# EAGLE design Anthe (EAGLE 9.6.2)
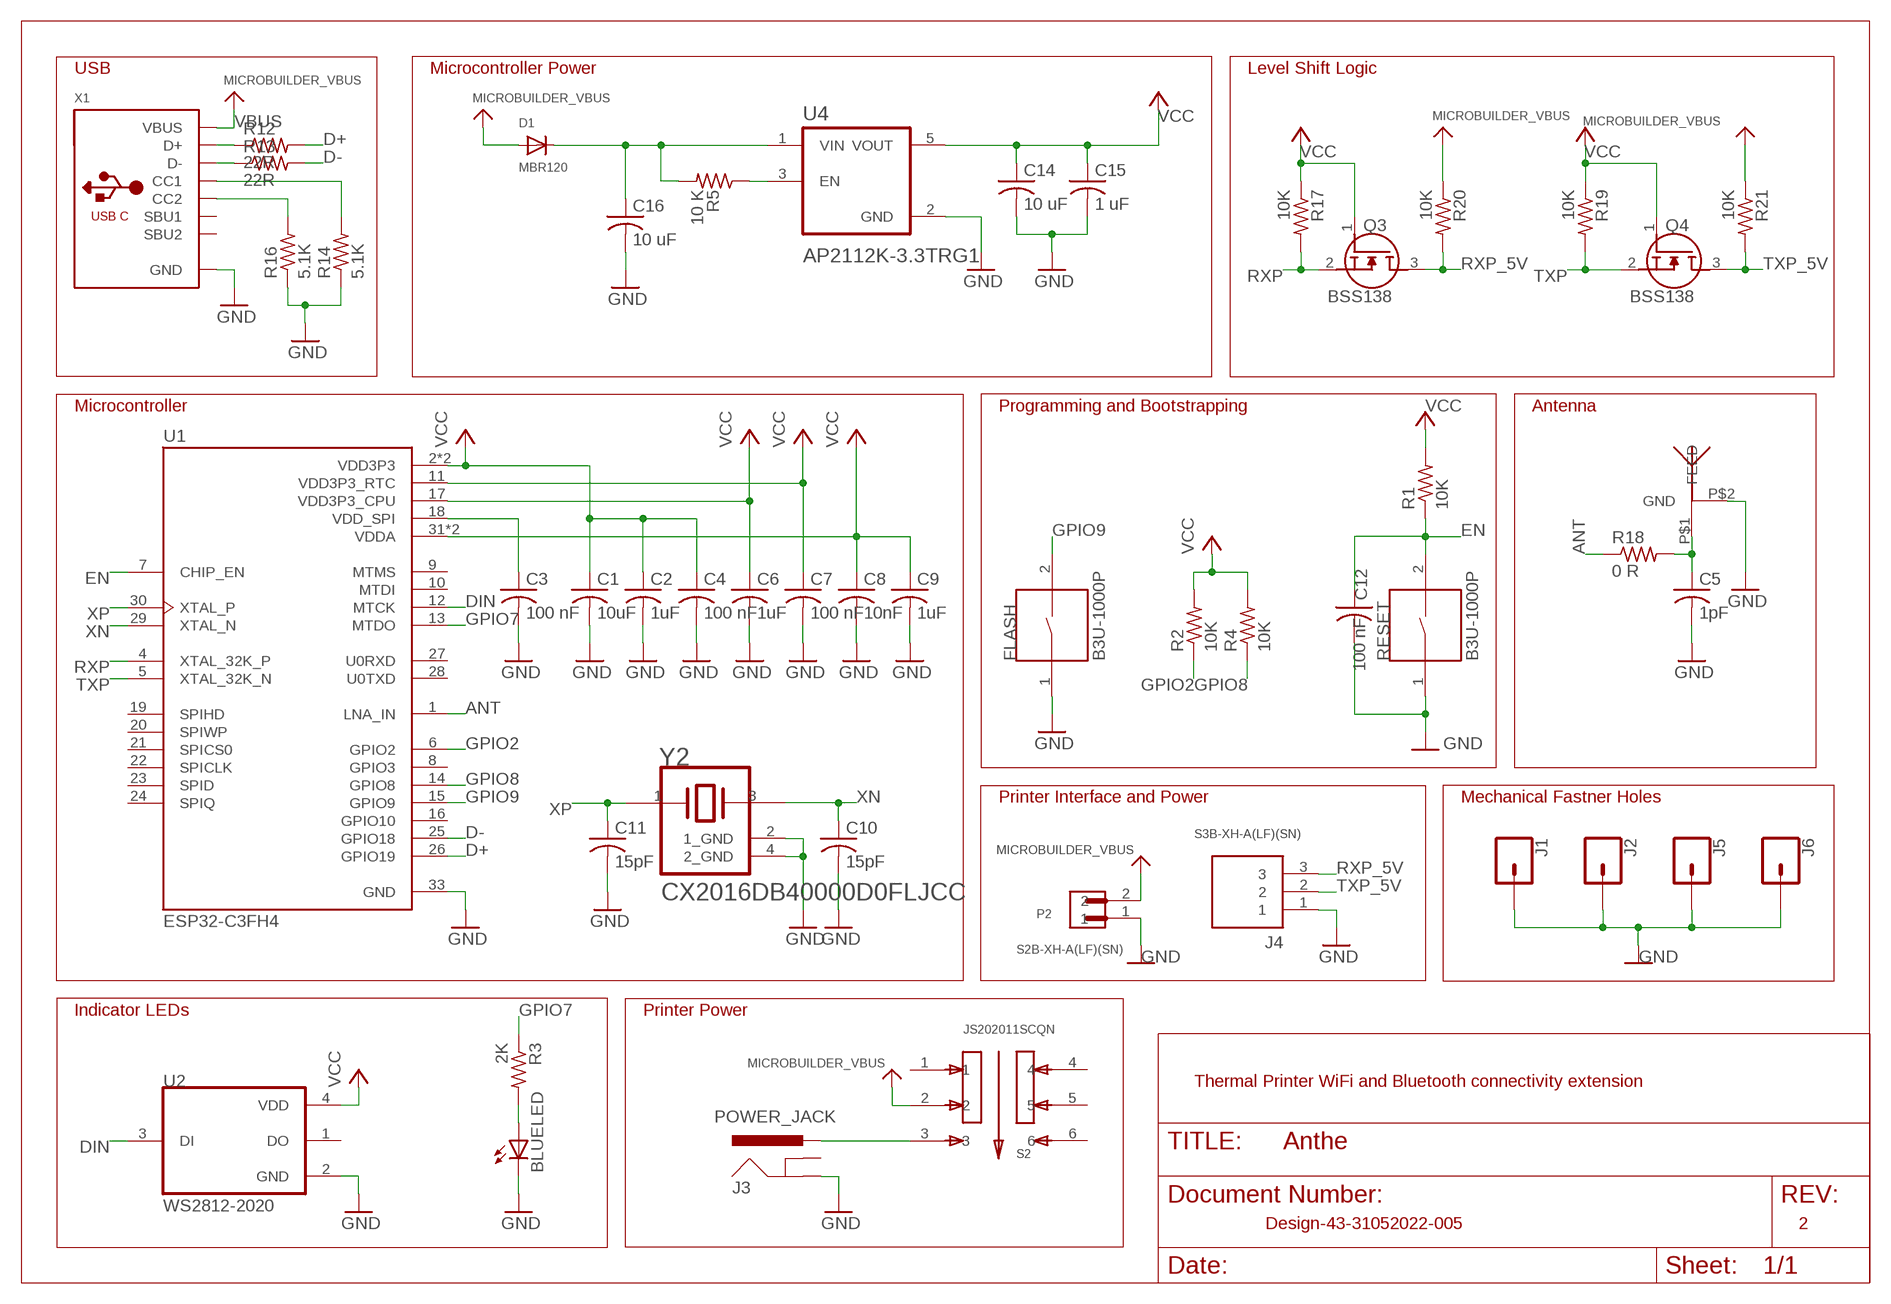
[diagram p0: schematic, sheet 1]

## Parts
BLUELED  LEDCHIPLED_0603  [CHIPLED_0603]
C1  10uF  C-USC0402  [C0402]
C2  1uF  C-USC0402  [C0402]
C3  100 nF  C-USC0402  [C0402]
C4  100 nF  C-USC0402  [C0402]
C5  1pF  C-USC0402  [C0402]
C6  1uF  C-USC0402  [C0402]
C7  100 nF  C-USC0402  [C0402]
C8  10nF  C-USC0402  [C0402]
C9  1uF  C-USC0402  [C0402]
C10  15pF  C-USC0402  [C0402]
C11  15pF  C-USC0402  [C0402]
C12  100 nF  C-USC0402  [C0402]
C14  10 uF  C-USC0402  [C0402]
C15  1 uF  C-USC0402  [C0402]
C16  10 uF  C-USC0402  [C0402]
D1  MBR120  DIODESOD-123  [SOD-123]
FLASH  B3U-1000P  [SW_B3U-1000P]
J1  CONN_01PTH_2MM  [1X01_2MM]
J2  CONN_01PTH_2MM  [1X01_2MM]
J3  POWER_JACK  [POWER_JACK_PTH]
J4  S3B-XH-A(LF)(SN)  [JST_S3B-XH-A(LF)(SN)]
J5  CONN_01PTH_2MM  [1X01_2MM]
J6  CONN_01PTH_2MM  [1X01_2MM]
P2  S2B-XH-A(LF)(SN)  [JST_S2B-XH-A(LF)(SN)]
Q3  BSS138  [SOT95P240X120-3N]
Q4  BSS138  [SOT95P240X120-3N]
R1  10K  R-US_R0402  [R0402]
R2  10K  R-US_R0402  [R0402]
R3  2K  R-US_R0402  [R0402]
R4  10K  R-US_R0402  [R0402]
R5  10 K  R-US_R0402  [R0402]
R12  22R  R-US_R0402  [R0402]
R13  22R  R-US_R0402  [R0402]
R14  5.1K  R-US_R0402  [R0402]
R16  5.1K  R-US_R0402  [R0402]
R17  10K  R-US_R0402  [R0402]
R18  0 R  R-US_R0402  [R0402]
R19  10K  R-US_R0402  [R0402]
R20  10K  R-US_R0402  [R0402]
R21  10K  R-US_R0402  [R0402]
RESET  B3U-1000P  [SW_B3U-1000P]
S2  JS202011SCQN  [SW_JS202011SCQN]
U1  ESP32-C3FH4  [QFN50P500X500X90-33N]
U2  WS2812-2020  [LED_WS2812-2020]
U4  AP2112K-3.3TRG1  [SOT95P285X140-5N]
U$3  PCB_ANTENNA_WIFI  [WIFI_ANTENNA]
X1  MICROBUILDER_USB_C  [MICROBUILDER_USB_C_CUSB31-CFM2AX-01-X]
Y2  KYOCERA_INTERNATIONAL_INC._ELECTRONIC_COMPONENTS_CX2016DB40000D0FLJCCKYOCERA_INTERNATIONAL_INC._ELECTRONIC_COMPONENTS_CX2016DB40000D0FLJCC_0_0  [KYOCERA_INTERNATIONAL_INC._ELECTRONIC_COMPONENTS_CX2016DB40000D0FLJCC_0]

## Nets
ANT: R18.1 U1.1(LNA_IN)
D+: R12.2 U1.26(GPIO19)
D-: R13.2 U1.25(GPIO18)
DIN: U1.12(MTCK) U2.3(DI)
EN: C12.1 R1.1 RESET.2 U1.7(CHIP_EN)
GND: BLUELED.C C1.2 C2.2 C3.2 C4.2 C5.2 C6.2 C7.2 C8.2 C9.2 C10.2 C11.2 C12.2 C14.2 C15.2 C16.2 FLASH.1 J1.1 J2.1 J3.GND J4.1 J5.1 J6.1 P2.1 R14.1 R16.1 RESET.1 U1.33(GND) U2.2(GND) U4.2(GND) U$3.P$2(GND) X1.A1B12(GND) X1.B1A12(GND) Y2.2(1_GND) Y2.4(2_GND)
GPIO2: R2.1 U1.6(GPIO2)
GPIO7: R3.1 U1.13(MTDO)
GPIO8: R4.1 U1.14(GPIO8)
GPIO9: FLASH.2 U1.15(GPIO9)
N$1: J3.PWR S2.3
N$2: C5.1 R18.2 U$3.P$1(FEED)
N$4: C3.1 U1.18(VDD_SPI)
N$5: BLUELED.A R3.2
N$8: R12.1 X1.A6(D+) X1.B6(D+)
N$10: C16.1 D1.C R5.2 U4.1(VIN)
N$13: R13.1 X1.A7(D-) X1.B7(D-)
N$14: R14.2 X1.A5(CC1)
N$15: R16.2 X1.B5(CC2)
N$31: R5.1 U4.3(EN)
RXP: Q3.2(S) R17.2 U1.4(XTAL_32K_P)
RXP_5V: J4.3 Q3.3(D) R20.2
TXP: Q4.2(S) R19.2 U1.5(XTAL_32K_N)
TXP_5V: J4.2 Q4.3(D) R21.2
VBUS: D1.A P2.2 R20.1 R21.1 S2.2 X1.A4B9(VBUS) X1.B4A9(VBUS) ; supply symbol labelled MICROBUILDER_VBUS
VCC: C1.1 C2.1 C4.1 C6.1 C7.1 C8.1 C9.1 C14.1 C15.1 Q3.1(G) Q4.1(G) R1.2 R2.2 R4.2 R17.1 R19.1 U1.2(VDD3P3) U1.3(VDD3P3) U1.11(VDD3P3_RTC) U1.17(VDD3P3_CPU) U1.31(VDDA) U1.32(VDDA) U2.4(VDD) U4.5(VOUT)
XN: C10.1 U1.29(XTAL_N) Y2.3
XP: C11.1 U1.30(XTAL_P) Y2.1
Unconnected: J3.GNDBREAK S2.1 S2.4 S2.5 S2.6 U1.8(GPIO3) U1.9(MTMS) U1.10(MTDI) U1.16(GPIO10) U1.19(SPIHD) U1.20(SPIWP) U1.21(SPICS0) U1.22(SPICLK) U1.23(SPID) U1.24(SPIQ) U1.27(U0RXD) U1.28(U0TXD) U2.1(DO) X1.A8(SBU1) X1.B8(SBU2)

## Notes on the sheet
- USB | Microcontroller Power | Level Shift Logic
- Microcontroller | Programming and Bootstrapping | Antenna
- Printer Interface and Power | Mechanical Fastner Holes
- Indicator LEDs | Printer Power
- Thermal Printer WiFi and Bluetooth connectivity extension
- Design-43-31052022-005 | 2

## Library data of the parts
BLUELED = adafruit:LED: LED OSRAM: - CHIPLED LG R971, LG N971, LY N971, LG Q971, LY Q971, LO R971, LY R971 LH N974, LH R974 LS Q976, LO Q976, LY Q976 LO Q996 - Hyper CHIPLED LW Q18S LB Q993, LB Q99A, LB R99A - SideLED LS A670, LO A670, LY A670, LG A670, LP A670 LB A673, LV A673, LT A673, LW A673 LH A674 LY A675 LS A676, LA A676, LO A676, LY A676, LW A676 LS A679, LY A679, LG A679 - Hyper Micro SIDELED® LS Y876, LA Y876, LO Y876, LY Y876 LT Y87S - SmartLED LW L88C, LW L88S LB L89C, LB L89S, LG L890 LS L89K, LO L89K, LY L89K LS L896, LA L896, LO L896, LY L896 - TOPLED LS T670, LO T670, LY T670, LG T670, LP T670 LSG T670, LSP T670, LSY T670, LOP T670, LYG T670 LG T671, LOG T671, LSG T671 LB T673, LV T673, LT T673, LW T673 LH T674 LS T676, LA T676, LO T676, LY T676, LB T676, LH T676, LSB T676, LW T676 LB T67C, LV T67C, LT T67C, LS T67K, LO T67K, LY T67K, LW E67C LS E67B, LA E67B, LO E67B, LY E67B, LB E67C, LV E67C, LT E67C LW T67C LS T679, LY T679, LG T679 LS T770, LO T770, LY T770, LG T770, LP T770 LB T773, LV T773, LT T773, LW T773 LH T774 LS E675, LA E675, LY E675, LS T675 LS T776, LA T776, LO T776, LY T776, LB T776 LHGB T686 LT T68C, LB T68C - Hyper Mini TOPLED® LB M676 - Mini TOPLED Santana® LG M470 LS M47K, LO M47K, LY M47K Source: http://www.osram.convergy.de/
C1-C12 C14-C16 = adafruit:C-US: CAPACITOR, American symbol
D1 = adafruit:DIODE: Diode SMADIODE - SMA Surface Mount Package 20V 1A Schottky Diode Digikey: 641-1014-6-ND DO-1N4148 - Through Hole Small Current Diode SOD-123 20V 1 A (.5mV Vf) Schottky Diode - Digikey: MBRX120TPMSCT-ND SOD-323 10V 570mA (.38mV Vf, 3ns) Schottky Diode - Digikey: ZLLS410CT-ND SOD-523 30V 30mA Schottky Diode (RB751S-40TE61) - Digikey: RB751S-40TE61CT-ND SOT23-R/W - SOT23 Package (R = Solder Paste/Reflow Ovens, W = Hand-Soldering) BAT54Film 40V 300mA - Digikey: 497-7162-1-ND
FLASH RESET = B3U-1000P:B3U-1000P: Switch Tactile N.O. SPST Round Button Gull Wing 0.05A 12VDC 1.5N SMD Embossed T/R; AVAILABILITY: Unavailable; DESCRIPTION: Switch Tactile N.O. SPST Round Button Gull Wing 0.05A 12VDC 1.5N SMD Embossed T/R; MF: Omron; MP: B3U-1000P; PACKAGE: None; PRICE: None
J1 J2 J5 J6 = SparkFun-Connectors:CONN_01: Single connection point. Often used as Generic Header-pin footprint for 0.1 inch spaced/style header connections On any of the 0.1 inch spaced packages, you can populate with these: Break Away Headers - Straight <https://www.sparkfun.com/products/116> (PRT-00116) Break Away Male Headers - Right Angle <https://www.sparkfun.com/products/553> (PRT-00553) Female Headers <https://www.sparkfun.com/products/115> (PRT-00115) Break Away Headers - Machine Pin <https://www.sparkfun.com/products/117> (PRT-00117) Break Away Female Headers - Swiss Machine Pin <https://www.sparkfun.com/products/743> (PRT-00743) This device is also useful as a general connection point to wire up your design to another part of your project. Our various solder wires solder well into these plated through hole pads. Hook-Up Wire - Assortment (Stranded, 22 AWG) <https://www.sparkfun.com/products/11375> (PRT-11375) Hook-Up Wire - Assortment (Solid Core, 22 AWG) <https://www.sparkfun.com/products/11367> (PRT-11367) View the entire wire category on our website here <https://www.sparkfun.com/categories/141> Special notes: SMTSO-256-ET is a "flush mount" nut for a 4-40 screw. We mostly use this on specialty testbeds; it is a nice way to connect hardware to your PCB at an adjustable hieght. Also note, the SNAP packages are for using a snappable style connector. We sell a baggie of snaps and they are also used on two LilyPad designs: Snap Assortment - 30 pack (male and female) <https://www.sparkfun.com/products/11347> (DEV-11347) LilyPad Arduino SimpleSnap <https://www.sparkfun.com/products/10941> (DEV-10941) LilyPad SimpleSnap Protoboard <https://www.sparkfun.com/products/10940> (DEV-10940)
J3 = SparkFun-Connectors:POWER_JACK: Power Jack Connector This is the standard 5.5mm barrel jack for power. The PTH is the most common, proven, reliable, footprint. The Slot footprint only works if the mill layer is transmitted to the PCB fab house so be warned. Here are the connectors we sell at SparkFun: DC Barrel Power Jack/Connector <https://www.sparkfun.com/products/119> (PRT-00119) DC Barrel Power Jack/Connector (SMD) <https://www.sparkfun.com/products/12748> (PRT-12748) DC Barrel Jack Adapter - Breadboard Compatible <https://www.sparkfun.com/products/10811> (PRT-10811) It is used on this SparkFun product (and many, many others): SparkFun RedBoard - Programmed with Arduino <https://www.sparkfun.com/products/12757> (DEV-12757) Also, if you need a mating power supply or connector, please check these out: Wall Adapter Power Supply - 9VDC 650mA <https://www.sparkfun.com/products/298> (TOL-00298) DC Barrel Jack Adapter - Male <https://www.sparkfun.com/products/10287> (PRT-10287); PROD_ID: CONN-08197
J4 = S3B-XH-A_LF__SN_:S3B-XH-A(LF)(SN): Connector Header Through Hole, Right Angle 3 position 0.098" (2.50mm) Check availability <https://pricing.snapeda.com/parts/S3B-XH-A%28LF%29%28SN%29/JST%20Sales%20America%20Inc./view-part?ref=eda>; AVAILABILITY: In Stock; DESCRIPTION: Connector Header Through Hole, Right Angle 3 position 0.098 (2.50mm); MF: JST Sales America Inc.; MP: S3B-XH-A(LF)(SN); PACKAGE: Custom Package JST Sales; PRICE: None; PURCHASE-URL: https://pricing.snapeda.com/search/part/S3B-XH-A(LF)(SN)/?ref=eda
P2 = S2B-XH-A_LF__SN_:S2B-XH-A(LF)(SN): XH Series 2.5mm 2 Position Through Hole Shrouded Header Connector Check availability <https://pricing.snapeda.com/parts/S2B-XH-A%20%28LF%29%28SN%29/JST%20Sales/view-part?ref=eda>; AVAILABILITY: In Stock; DESCRIPTION: Connector Header Through Hole, Right Angle 2 position 0.098 (2.50mm); MF: JST Sales; MP: S2B-XH-A (LF)(SN); PACKAGE: None; PRICE: None; PURCHASE-URL: https://pricing.snapeda.com/search/part/S2B-XH-A (LF)(SN)/?ref=eda
Q3 Q4 = BSS138:BSS138: N-channel MOSFET,BSS138 0.2A 50V Source: Datasheet <https://componentsearchengine.com/Datasheets/1/BSS138.pdf>; DESCRIPTION: N-channel MOSFET,BSS138 0.2A 50V; HEIGHT: 1.2mm; MANUFACTURER_NAME: ON Semiconductor; MANUFACTURER_PART_NUMBER: BSS138; MOUSER_PART_NUMBER: 512-BSS138; MOUSER_PRICE-STOCK: https://www.mouser.com/Search/Refine.aspx?Keyword=512-BSS138
R1-R5 R12-R14 R16-R21 = adafruit:R-US_: RESISTOR, American symbol
S2 = JS202011SCQN:JS202011SCQN: JS Series DPDT On-On Gull Wing Surface Mount Subminiature Slide Switch; AVAILABILITY: Unavailable; DESCRIPTION: Slide Switch DPDT Surface Mount; MF: C&K; MP: JS202011SCQN; PACKAGE: None; PRICE: None
U1 = ESP32-C3FH4:ESP32-C3FH4: Check availability <https://pricing.snapeda.com/parts/ESP32-C3FH4/Espressif%20Systems/view-part?ref=eda>; AVAILABILITY: In Stock; DESCRIPTION: Bluetooth, WiFi 802.11b/g/n, Bluetooth v5.0 Transceiver Module 2.402GHz ~ 2.48GHz Antenna Not Included Surface Mount; MF: Espressif Systems; MP: ESP32-C3FH4; PACKAGE: VFQFN-32 Espressif Systems; PRICE: None; PURCHASE-URL: https://pricing.snapeda.com/search/part/ESP32-C3FH4/?ref=eda
U2 = WS2812-2020:WS2812-2020: Intelligent control LED integrated light source Check availability <https://pricing.snapeda.com/parts/WS2812-2020/Worldsemi/view-part?ref=eda>; AVAILABILITY: Not in stock; DESCRIPTION: Intelligent control LED light source, SMD-4; MF: Worldsemi; MP: WS2812-2020; PACKAGE: Package; PRICE: None
U4 = AP2112K-3.3TRG1:AP2112K-3.3TRG1: AP2112 Series 0.6 A 3.3 V Fixed Output SMT LDO Linear Regulator - SOT23-5; AVAILABILITY: Unavailable; DESCRIPTION: AP2112 Series 0.6 A 3.3 V Fixed Output SMT LDO Linear Regulator - SOT23-5; MF: Diodes Inc.; MP: AP2112K-3.3TRG1; PACKAGE: SOT-753 Diodes Inc.; PRICE: None
U$3 = WiFi_PCB_Trace_Antenna:PCB_ANTENNA_WIFI
X1 = Adafruit Feather STM32F405 Express:MICROBUILDER_USB_C: USB Type-C USB 2.0 Connector
Y2 = Kyocera International Inc. Electronic Components - CX2016DB40000D0FLJCC:KYOCERA_INTERNATIONAL_INC._ELECTRONIC_COMPONENTS_CX2016DB40000D0FLJCC: CRYSTAL 40.0000MHZ 8PF SMD; AUTOMOTIVE: No; CENTROID_NOT_SPECIFIED: No; DATASHEET: https://global.kyocera.com/prdct/electro/product/pdf/cx2016db_e.pdf; DEVICE_CLASS_L1: Passive Components; DEVICE_CLASS_L2: Crystals / Oscillators; DEVICE_CLASS_L3: Crystals; DIGIKEY_DESCRIPTION: CRYSTAL 40.0000MHZ 8PF SMD; DIGIKEY_PART_NUMBER: 1253-1120-1-ND; ESR: 50Ω; FOOTPRINT_VARIANT_NAME_0: Recommended_Land_Pattern; FREQUENCY: 40MHz; HEIGHT: 0.45mm; LEAD_FREE: Yes; LOAD_CAPACITANCE: 8pF; MF: Kyocera International Inc. Electronic Components; MFG_PACKAGE_IDENT: CX2016DB; MFG_PACKAGE_IDENT_DATE: 0; MFG_PACKAGE_IDENT_REV: 0; MOUSER_DESCRIPTION: Crystal 40MHz 8pF 4-Pin SMD T/R; MOUSER_PART_NUMBER: 581-CX2016DB40DFLJCC; MPN: CX2016DB40000D0FLJCC; PACKAGE: SMT_2MM0_1MM6; PREFIX: Y; ROHS: Yes; SERIES: CX2016DB; STABILITY: 15ppm; TEMPERATURE_RANGE_HIGH: +85°C; TEMPERATURE_RANGE_LOW: -30°C; TOLERANCE: 15ppm; VERIFICATION_VERSION: 0.0.0.2

## Board
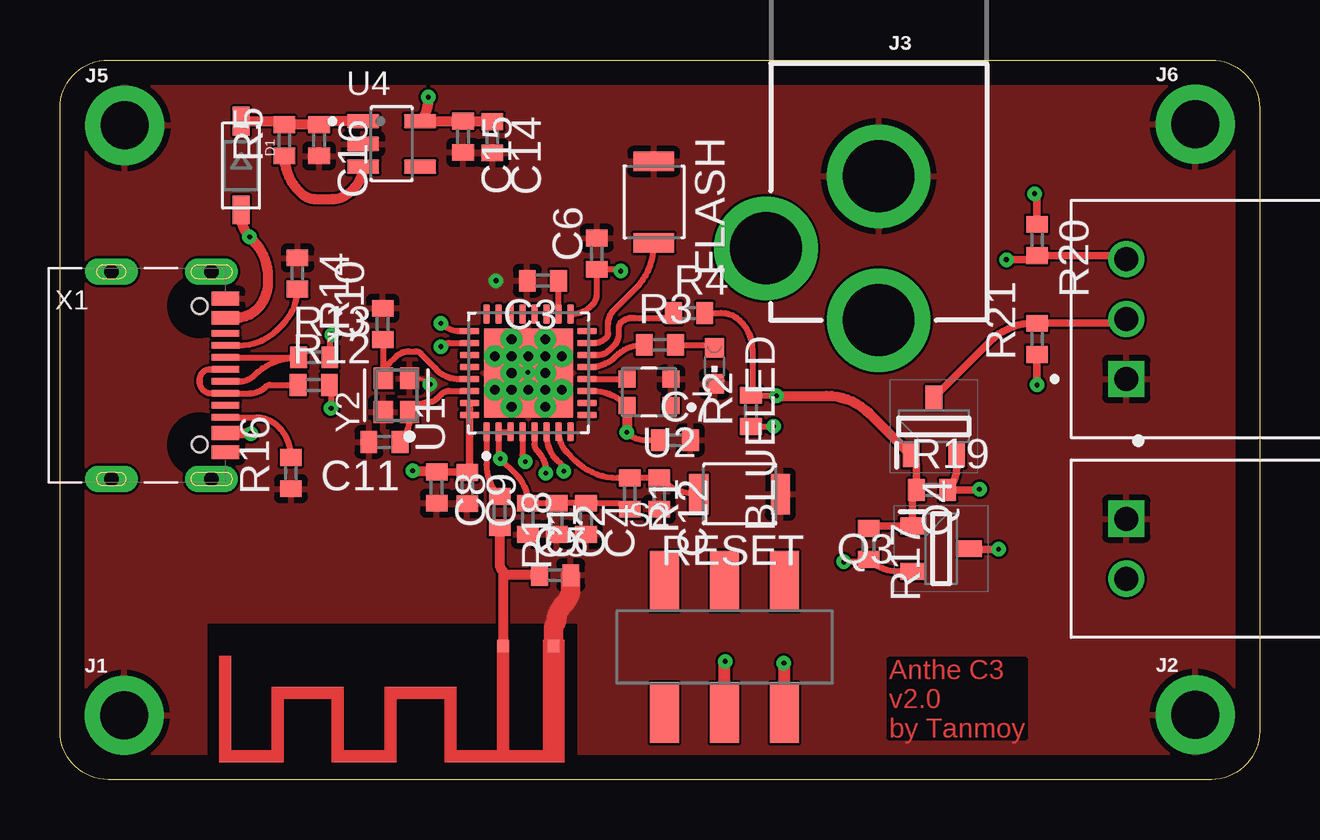
[diagram p1: board, top side]
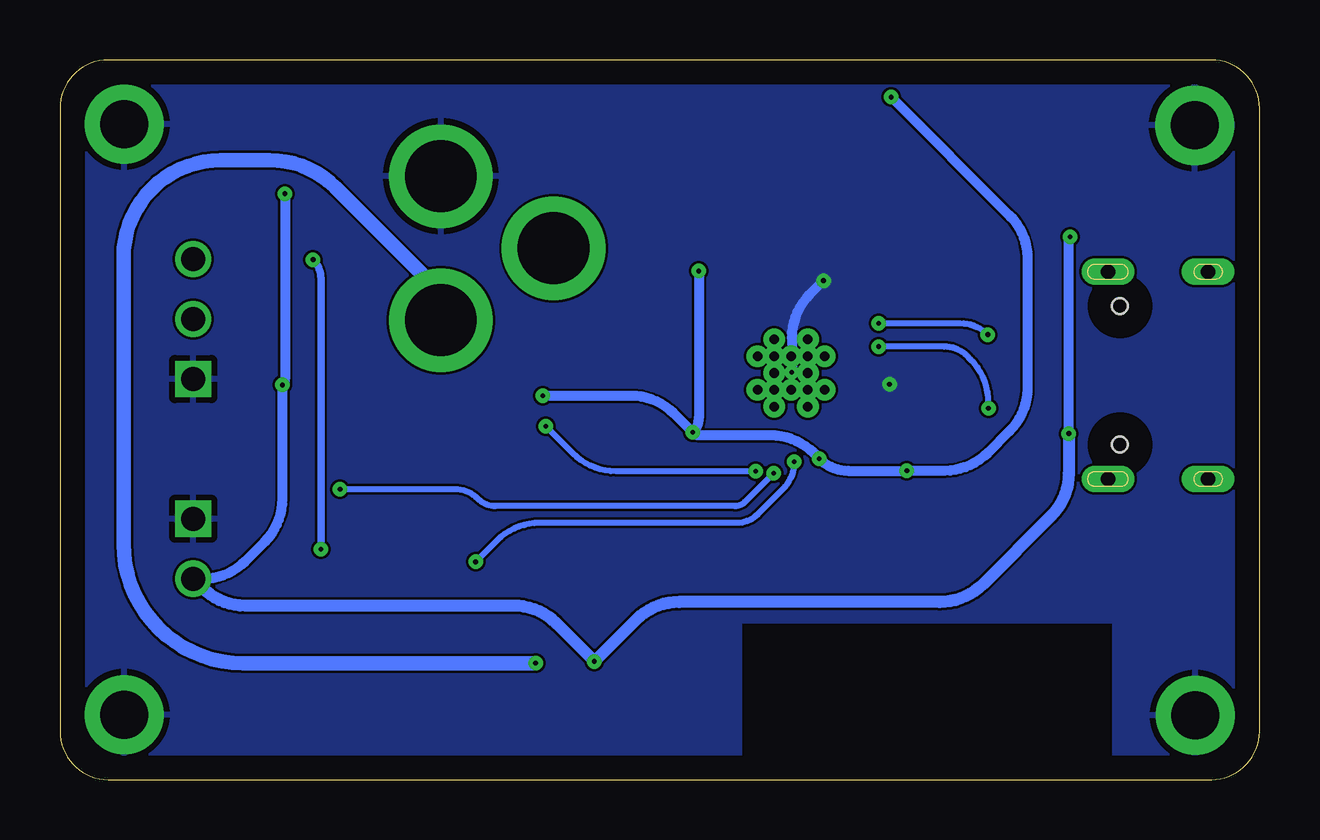
[diagram p2: board, bottom side, seen from below]

Size 50 x 30 mm. Coordinates in mm from the lower left corner, seen from the top.
Outline: 2,30 48,30 arc-90 50,28 50,2 arc-90 48,0 2,0 arc-90 0,2 0,28 arc-90 2,30
Copper layers (1*16): Top 0.035mm / dielectric 1.5mm / Bottom 0.035mm
Design rules "default *": minimum track width 4mil, minimum drill 0.2mm, track to track 4mil, track to pad 4mil, pad to pad 4mil, via to via 4mil, smd to smd 4mil, copper to edge 40mil, drill to drill 4mil, minimum pad ring 10mil, minimum via ring 8mil, stop-mask expansion 4mil, vias tented up to drill 0mil, thermal gap 10mil

### Footprints (pad centres in the part's own frame; a part is rotated, then mirrored left to right if it is on the bottom)
CHIPLED_0603 = smd 0.8 x 0.8: A 0,-0.75; C 0,0.75
C0402 = smd 0.7 x 0.9: 1 -0.65,0; 2 0.65,0
SOD-123 = smd 1.2 x 0.7: A 1.85,0; C -1.85,0
SW_B3U-1000P = smd 0.8 x 1.7: 1 -1.7,0; 2 1.7,0
1X01_2MM = drill 2 pad 3.302: 1 0,0
POWER_JACK_PTH = drill 2.997 pad 4.318: GND 0,7.7; GNDBREAK 4.7,10.7; PWR 0,13.7
JST_S3B-XH-A(LF)(SN) = drill 1 square: 1 2.5,-3.45 | drill 1: 2 0,-3.45; 3 -2.5,-3.45
JST_S2B-XH-A(LF)(SN) = drill 1 square: 1 -1.25,0 | drill 1: 2 1.25,0
SOT95P240X120-3N = smd 1 x 0.7: 1 -1.2,0.95; 2 -1.2,-0.95; 3 1.2,0
R0402 = smd 0.7 x 0.9: 1 -0.65,0; 2 0.65,0
SW_JS202011SCQN = smd 1.2 x 2.5: 1 -2.5,-2.75; 2 0,-2.75; 3 2.5,-2.75; 4 -2.5,2.75; 5 0,2.75; 6 2.5,2.75
QFN50P500X500X90-33N = smd 0.81 x 0.27: 1 -2.45,1.75; 2 -2.45,1.25; 3 -2.45,0.75; 4 -2.45,0.25; 5 -2.45,-0.25; 6 -2.45,-0.75; 7 -2.45,-1.25; 8 -2.45,-1.75; 17 2.45,-1.75; 18 2.45,-1.25; 19 2.45,-0.75; 20 2.45,-0.25; 21 2.45,0.25; 22 2.45,0.75; 23 2.45,1.25; 24 2.45,1.75 | smd 0.27 x 0.81: 9 -1.75,-2.45; 10 -1.25,-2.45; 11 -0.75,-2.45; 12 -0.25,-2.45; 13 0.25,-2.45; 14 0.75,-2.45; 15 1.25,-2.45; 16 1.75,-2.45; 25 1.75,2.45; 26 1.25,2.45; 27 0.75,2.45; 28 0.25,2.45; 29 -0.25,2.45; 30 -0.75,2.45; 31 -1.25,2.45; 32 -1.75,2.45 | smd 3.7 x 3.7: 33 0,0 | drill 0.4 pad 0.5: 34 -0.7,1.4; 35 0.7,1.4; 36 -1.4,0.7; 37 -0.7,0.7; 38 0,0.7; 39 0.7,0.7; 40 1.4,0.7; 41 -0.7,0; 42 0.7,0; 43 -1.4,-0.7; 44 -0.7,-0.7; 45 0,-0.7; 46 0.7,-0.7; 47 1.4,-0.7; 48 -0.7,-1.4; 49 0.7,-1.4
LED_WS2812-2020 = smd 0.7 x 0.7: 1 -0.915,0.55; 2 -0.915,-0.55; 3 0.915,-0.55; 4 0.915,0.55
SOT95P285X140-5N = smd 1.35 x 0.6: 1 -1.185,0.95; 2 -1.185,0; 3 -1.185,-0.95; 4 1.185,-0.95; 5 1.185,0.95
WIFI_ANTENNA = smd 0.5 x 0.5: P$1 2.1,0.25; P$2 0,0.25
MICROBUILDER_USB_C_CUSB31-CFM2AX-01-X = smd 0.575 x 1.15: A1B12 -3.2,3.545; A4B9 -2.4,3.545; B1A12 3.2,3.545; B4A9 2.4,3.545 | smd 0.275 x 1.15: A5 -1.25,3.545; A6 -0.25,3.545; A7 0.25,3.545; A8 1.25,3.545; B5 1.75,3.545; B6 0.75,3.545; B7 -0.75,3.545; B8 -1.75,3.545 | drill 0.6 pad 1 long: M1 -4.32,2.97; M2 4.32,2.97; M3 -4.32,-1.21; M4 4.32,-1.21 | hole 0.65: 2.89,2.47; -2.89,2.47
KYOCERA_INTERNATIONAL_INC._ELECTRONIC_COMPONENTS_CX2016DB40000D0FLJCC_0 = smd 0.9 x 0.8: 1 -0.7,-0.55; 2 0.7,-0.55; 3 0.7,0.55; 4 -0.7,0.55

### Placement (x,y rotation side)
BLUELED  27.27,17.25 180 top
C1  19.5,10.88 270 top
C2  20.7,10.88 270 top
C3  20.12,20.8 180 top
C4  21.93,10.88 270 top
C5  20.64,8.53 0 top
C6  22.38,21.93 90 top
C7  25.62,14.15 0 top
C8  15.7,12.18 270 top
C9  16.98,12.15 270 top
C10  13.45,19 90 top
C11  13.53,14.07 180 top
C12  24.98,11.93 270 top
C14  18.02,26.77 270 top
C15  16.8,26.8 270 top
C16  10.8,26.65 270 top
D1  7.55,25.6 270 top
FLASH  24.75,24.07 270 top
J1  2.67,2.67 0 top
J2  47.33,2.7 0 top
J3  34.12,32.85 180 top
J4  47.9,19.2 270 top
J5  2.7,27.27 0 top
J6  47.33,27.32 0 top
P2  44.45,9.62 270 top
Q3  36.73,9.62 0 top
Q4  36.42,14.72 90 top
R1  23.75,11.93 270 top
R2  28.8,15.38 90 top
R3  25,18.12 0 top
R4  26.23,19.45 0 top
R5  9.35,26.65 90 top
R12  10.57,16.45 0 top
R13  10.6,17.6 0 top
R14  9.9,21.1 270 top
R16  9.62,12.78 90 top
R17  33.7,9.82 270 top
R18  18.32,11.15 270 top
R19  36.35,12.07 0 top
R20  40.73,22.5 270 top
R21  40.73,18.38 90 top
RESET  28.32,11.9 180 top
S2  27.7,5.53 0 top
U1  19.52,16.95 90 top
U2  24.55,16.15 180 top
U4  13.82,26.5 0 top
U$3  20.57,5.83 180 top
X1  3.35,16.85 270 top
Y2  14.03,16.02 90 top

### Tracks (layer width: path | path; a pad name or v marks a point on that pad's centre or on a via)
ANT
  Top 0.254: U1.1 17.77,13.13 arc45 R18.1
D+  (via drill 0.2)
  Top 0.254: R12.2 arc-45 11.3,16.27 v11.3,15.47 | v15.88,18.05 arc-45 16.24,18.2 U1.26
  Bottom 0.254: v11.3,15.47 11.3,15.72 arc-45 12.04,17.52 12.18,17.65 arc-45 13.14,18.05 v15.88,18.05
D-  (via drill 0.2)
  Top 0.254: R13.2 11.25,18.37 arc-45 v11.32,18.55 | v15.88,19.02 arc45 16.66,18.7 U1.25
  Bottom 0.254: v15.88,19.02 12.47,19.02 arc45 v11.32,18.55
DIN
  Top 0.254: U1.12 U2.3
EN
  Top 0.254: U1.7 arc45 21.13,13.65 21.46,13.32 arc45 23.25,12.57 R1.1 C12.1 arc45 26.61,11.9 RESET.2
GND  (via drill 0.2)
  Top 0.152: Y2.2 14.82,16.73 arc-45 v15.43,16.48 | U1.33 v19.5,16.98
  Top 0.813: C5.2 21.29,8 arc-45 21,7.3 arc45 20.68,6.54 | 20.65,6.5 20.68,6.54 | U$3.P$2 20.57,6.27 arc-45 20.68,6.54
  Bottom 0.406: v18.18,20.8 18.76,20.22 arc-45 19.5,18.42 v19.5,16.98
  pour Top: 2.25,29.75 47.75,29.75 arc-90 49.75,27.75 49.75,2.25 arc-90 47.75,0.25 2.25,0.25 arc-90 0.25,2.25 0.25,27.75 arc-90
  pour Bottom: 2.25,29.75 47.75,29.75 arc-90 49.75,27.75 49.75,2.25 arc-90 47.75,0.25 2.25,0.25 arc-90 0.25,2.25 0.25,27.75 arc-90
GPIO2  (via drill 0.2)
  Top 0.254: U1.6 20.27,14.35 arc45 20.7,13.32 20.88,13.15 arc-45 v21,12.85 | R2.1 v29.75,14.72
  Bottom 0.254: v21,12.85 26.82,12.85 arc45 28.62,13.59 v29.75,14.72
GPIO7
  Top 0.254: U1.13 22.09,17.2 arc45 23.18,17.65 arc-45 24.32,18.12 R3.1
GPIO8
  Top 0.254: U1.14 22.39,17.7 arc45 22.92,17.92 23.1,18.1 arc45 23.3,18.58 23.3,18.87 arc-45 23.38,19.05 arc-45 23.86,19.25 23.95,19.25 25.09,19.25 arc45 R4.1
GPIO9
  Top 0.254: 24.44,22.38 FLASH.2 24.75,22.28 arc-45 24.01,20.48 23.08,19.56 arc45 22.85,19 22.85,18.61 arc-45 22.77,18.43 arc-45 22.23,18.2 U1.15
N$1  (via drill 0.2)
  Top 0.508: S2.3 30.2,4.79 arc45 v30.18,4.85
  Bottom 0.61: J3.PWR arc-45 34.94,21.11 38.5,24.68 arc-45 41.27,25.82 43.3,25.82 arc-45 46.16,24.64 arc-45 47.35,21.77 47.35,9.83 arc-45 45.89,6.31 arc-45 42.37,4.85 v30.18,4.85
N$2
  Top 0.406: R18.2 18.32,9 arc45 18.45,8.7 | 18.45,8.7 arc-45 18.53,8.52 | 18.53,8.52 arc-45 18.55,8.53 C5.1 | 18.55,8.49 18.53,8.52 | 18.45,8.7 arc-45 18.48,8.64 U$3.P$1
N$4
  Top 0.254: U1.18 C3.1
N$5
  Top 0.254: R3.2 26.97,18.12 arc-45 BLUELED.A
N$8
  Top 0.254: X1.A6 6.25,17.1 arc45 5.95,16.98 arc45 5.83,16.67 5.83,16.57 arc45 5.97,16.23 5.97,16.23 arc45 6.28,16.1 X1.B6 7.91,16.1 arc45 8.57,16.38 arc-45 8.76,16.45 R12.1
N$10
  Top 0.406: D1.C 8.99,27.45 arc-45 R5.2 C16.1 arc-45 11.16,27.45 U4.1
N$13
  Top 0.254: X1.B7 R13.1 9.9,17.6 arc45 8.11,16.86 8.1,16.85 arc-45 7.5,16.6 X1.A7
N$14
  Top 0.254: X1.A5 7.48,18.1 arc45 9.05,18.75 9.3,19 arc45 R14.2
N$15
  Top 0.254: X1.B5 8.19,15.1 arc-45 9.09,14.73 arc-45 R16.2
N$31
  Top 0.406: R5.1 arc45 9.95,24.55 10.07,24.43 arc45 10.62,24.2 11.35,24.2 arc45 12.12,24.52 12.28,24.68 arc45 U4.3
NONE
  cutout Top: 21.55,6.5 6.15,6.5 6.15,0.25 21.55,0.25
  cutout Bottom: 6.15,6.5 21.55,6.5 21.55,0.25 6.15,0.25
RXP  (via drill 0.2)
  Top 0.254: U1.4 19.27,13.55 arc45 v19.4,13.25 | v32.67,9.07 33.46,9.07 arc45 R17.2 arc45 34.91,8.68 Q3.2
  Bottom 0.254: v19.4,13.25 arc45 19.88,12.1 20.93,11.05 arc45 21.77,10.7 30,10.7 arc-45 31.79,9.96 v32.67,9.07
RXP_5V  (via drill 0.2)
  Top 0.305: J4.3 arc45 44.09,21.85 R20.2 arc-45 40.3,21.68 v39.45,21.68 | v39.12,9.6 37.98,9.6 arc-45 Q3.3
  Bottom 0.305: v39.12,9.6 39.12,20.89 arc-45 v39.45,21.68
TXP  (via drill 0.2)
  Top 0.254: U1.5 19.77,14 arc45 19.9,13.7 arc-45 20.25,12.86 v20.25,12.78
  Top 0.305: Q4.2 37.38,12.98 arc-45 R19.2 38.27,12.07 arc45 v38.33,12.1
  Bottom 0.254: v20.25,12.78 21.45,11.58 arc45 21.88,11.4 31.85,11.4 arc45 32.58,11.7 arc-45 33.54,12.1 v38.33,12.1
TXP_5V
  Top 0.305: Q4.3 38.78,18.28 arc-45 40.58,19.02 R21.2 44.03,19.02 arc45 J4.2
VBUS  (via drill 0.2)
  Top 0.305: R20.1 40.73,24.18 arc45 v40.62,24.43 | R21.1 v40.73,16.45
  Top 0.406: X1.B4A9 7.89,14.45 arc-45 v7.95,14.43 | X1.A4B9 7.32,19.25 arc45 8.22,19.62 arc45 8.68,20.71 8.68,20.98 arc45 8.06,22.46 v7.9,22.62 arc-45 7.55,23.47 D1.A 7.55,23.7
  Top 0.508: S2.2 27.7,4.87 arc-45 v27.73,4.92
  Bottom 0.406: v7.95,14.43 7.95,22.5 arc45 v7.9,22.62 | v40.62,24.43 40.62,16.69 arc45 v40.73,16.45 40.73,11.7 arc45 41.47,9.91 42.26,9.12 arc45 44.05,8.38 P2.2
  Bottom 0.508: v7.95,14.43 7.95,12.78 arc45 8.69,10.98 11.53,8.14 arc45 13.33,7.4 24.2,7.4 arc-45 25.99,6.66 v27.73,4.92 29.31,6.51 arc-45 31.1,7.25 42.27,7.25 arc45 44.07,7.99 P2.2
VCC  (via drill 0.2)
  Top 0.254: U1.3 U1.2 18.27,13.56 arc45 v18.35,13.38 19,12.72 arc-45 C1.1 C2.1 C4.1 23.15,11.53 arc-45 R1.2 | U1.11 22.19,16.2 arc-45 U2.4 | v23.62,14.47 arc45 24.41,14.15 C7.1 | U1.17 arc45 22.17,19.77 22.2,19.8 arc45 22.38,20.22 C6.1 23.19,21.27 arc-45 v23.38,21.2 | v29.88,16 28.86,16 | 28.86,16 arc-45 R2.2 | R4.2 27.57,19.45 arc-45 28.35,19.12 arc-45 28.86,17.89 28.86,16
  Top 0.305: U1.31 U1.32 17.07,12.9 C9.1 16.95,12.82 C8.1 | Q4.1 arc-45 35.7,12.98 R19.1 arc45 35.52,11.65 Q3.1 33.94,10.57 arc45 R17.1
  Top 0.406: C14.1 16.86,27.43 arc-45 C15.1 U4.5 arc45 15.35,28.27 v15.35,28.45 | v14.7,12.88 15.58,12.88 arc-45 C8.1 | U2.4 23.64,14.5 arc-45 v23.62,14.47 | v29.88,16 31.95,16 arc-45 33.74,15.26 Q4.1
  Bottom 0.406: v15.35,28.45 10.42,23.52 arc45 9.68,21.72 9.68,16.33 arc45 10.42,14.53 11.33,13.62 arc45 13.13,12.88 v14.7,12.88 17.14,12.88 arc45 v18.35,13.38 18.58,13.61 arc-45 20.38,14.35 23.32,14.35 arc45 v23.62,14.47 | v23.62,14.47 24.41,15.26 arc-45 26.2,16 v29.88,16 | v23.38,21.2 23.38,15.08 arc45 v23.62,14.47
XN
  Top 0.254: U1.29 16.64,16.7 arc-45 15.68,17.1 arc45 15.66,17.14 15.04,17.76 arc45 14.82,17.85 14.54,17.85 arc45 14,17.62 13.74,17.36 arc45 Y2.3 13.47,18.29 arc45 C10.1
XP
  Top 0.254: C11.1 arc45 14.57,15.04 Y2.1 14.71,15.46 arc-45 15.35,15.72 arc45 15.69,15.87 15.88,16.05 arc-45 16.24,16.2 U1.30

### Text on the board
Top: Anthe C3 / v2.0 / by Tanmoy